# EasyEDA Pro project DCDC.eprj, board FSBB_自举驱动
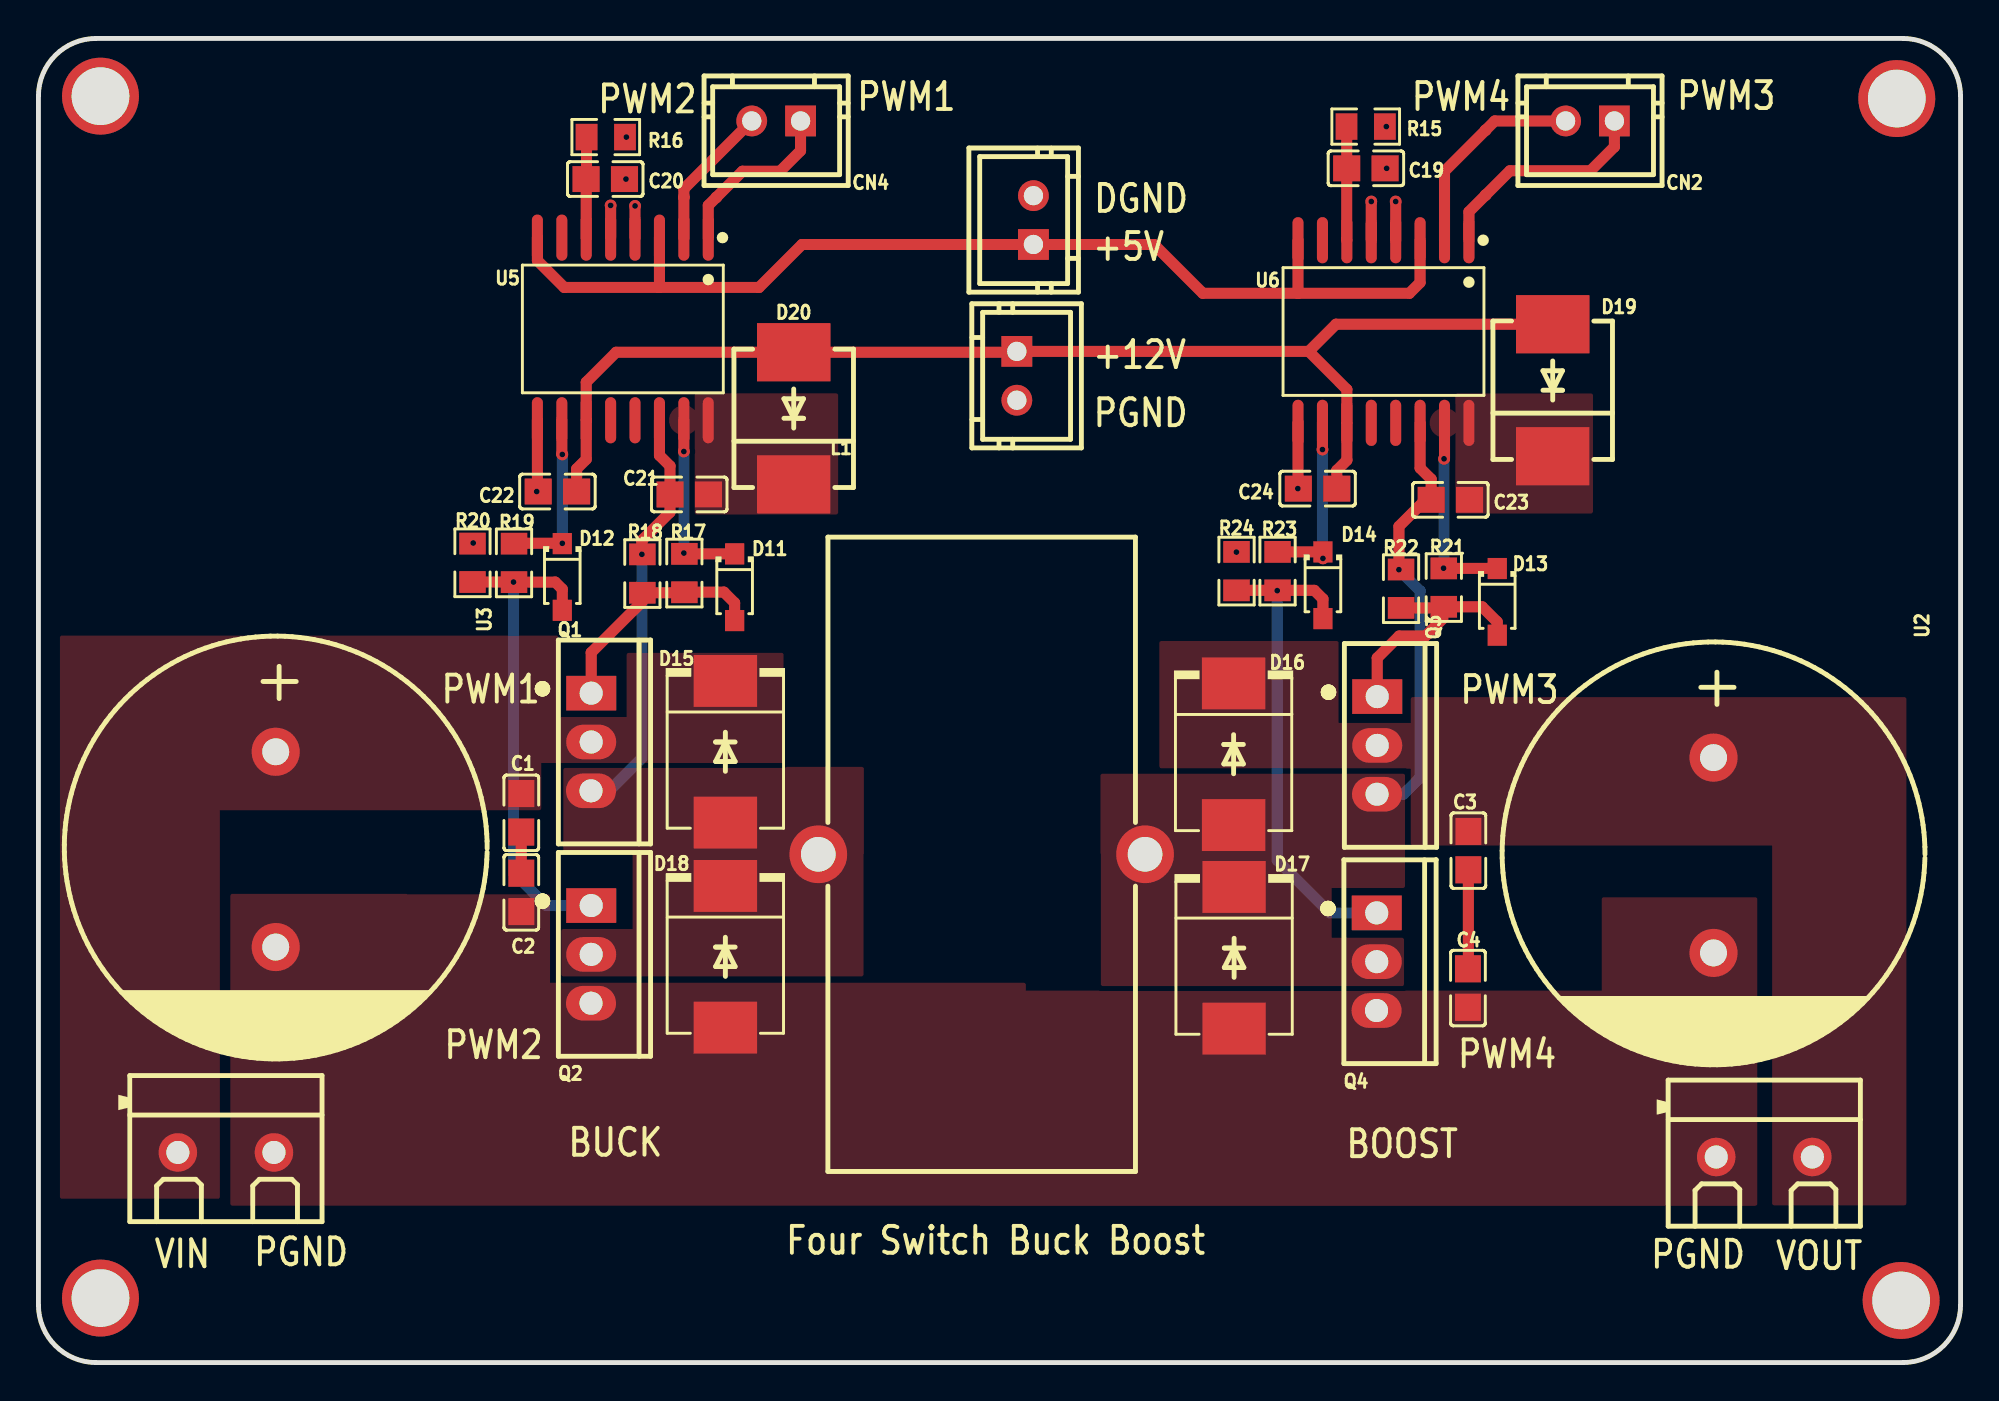
[diagram p6: board, top side]
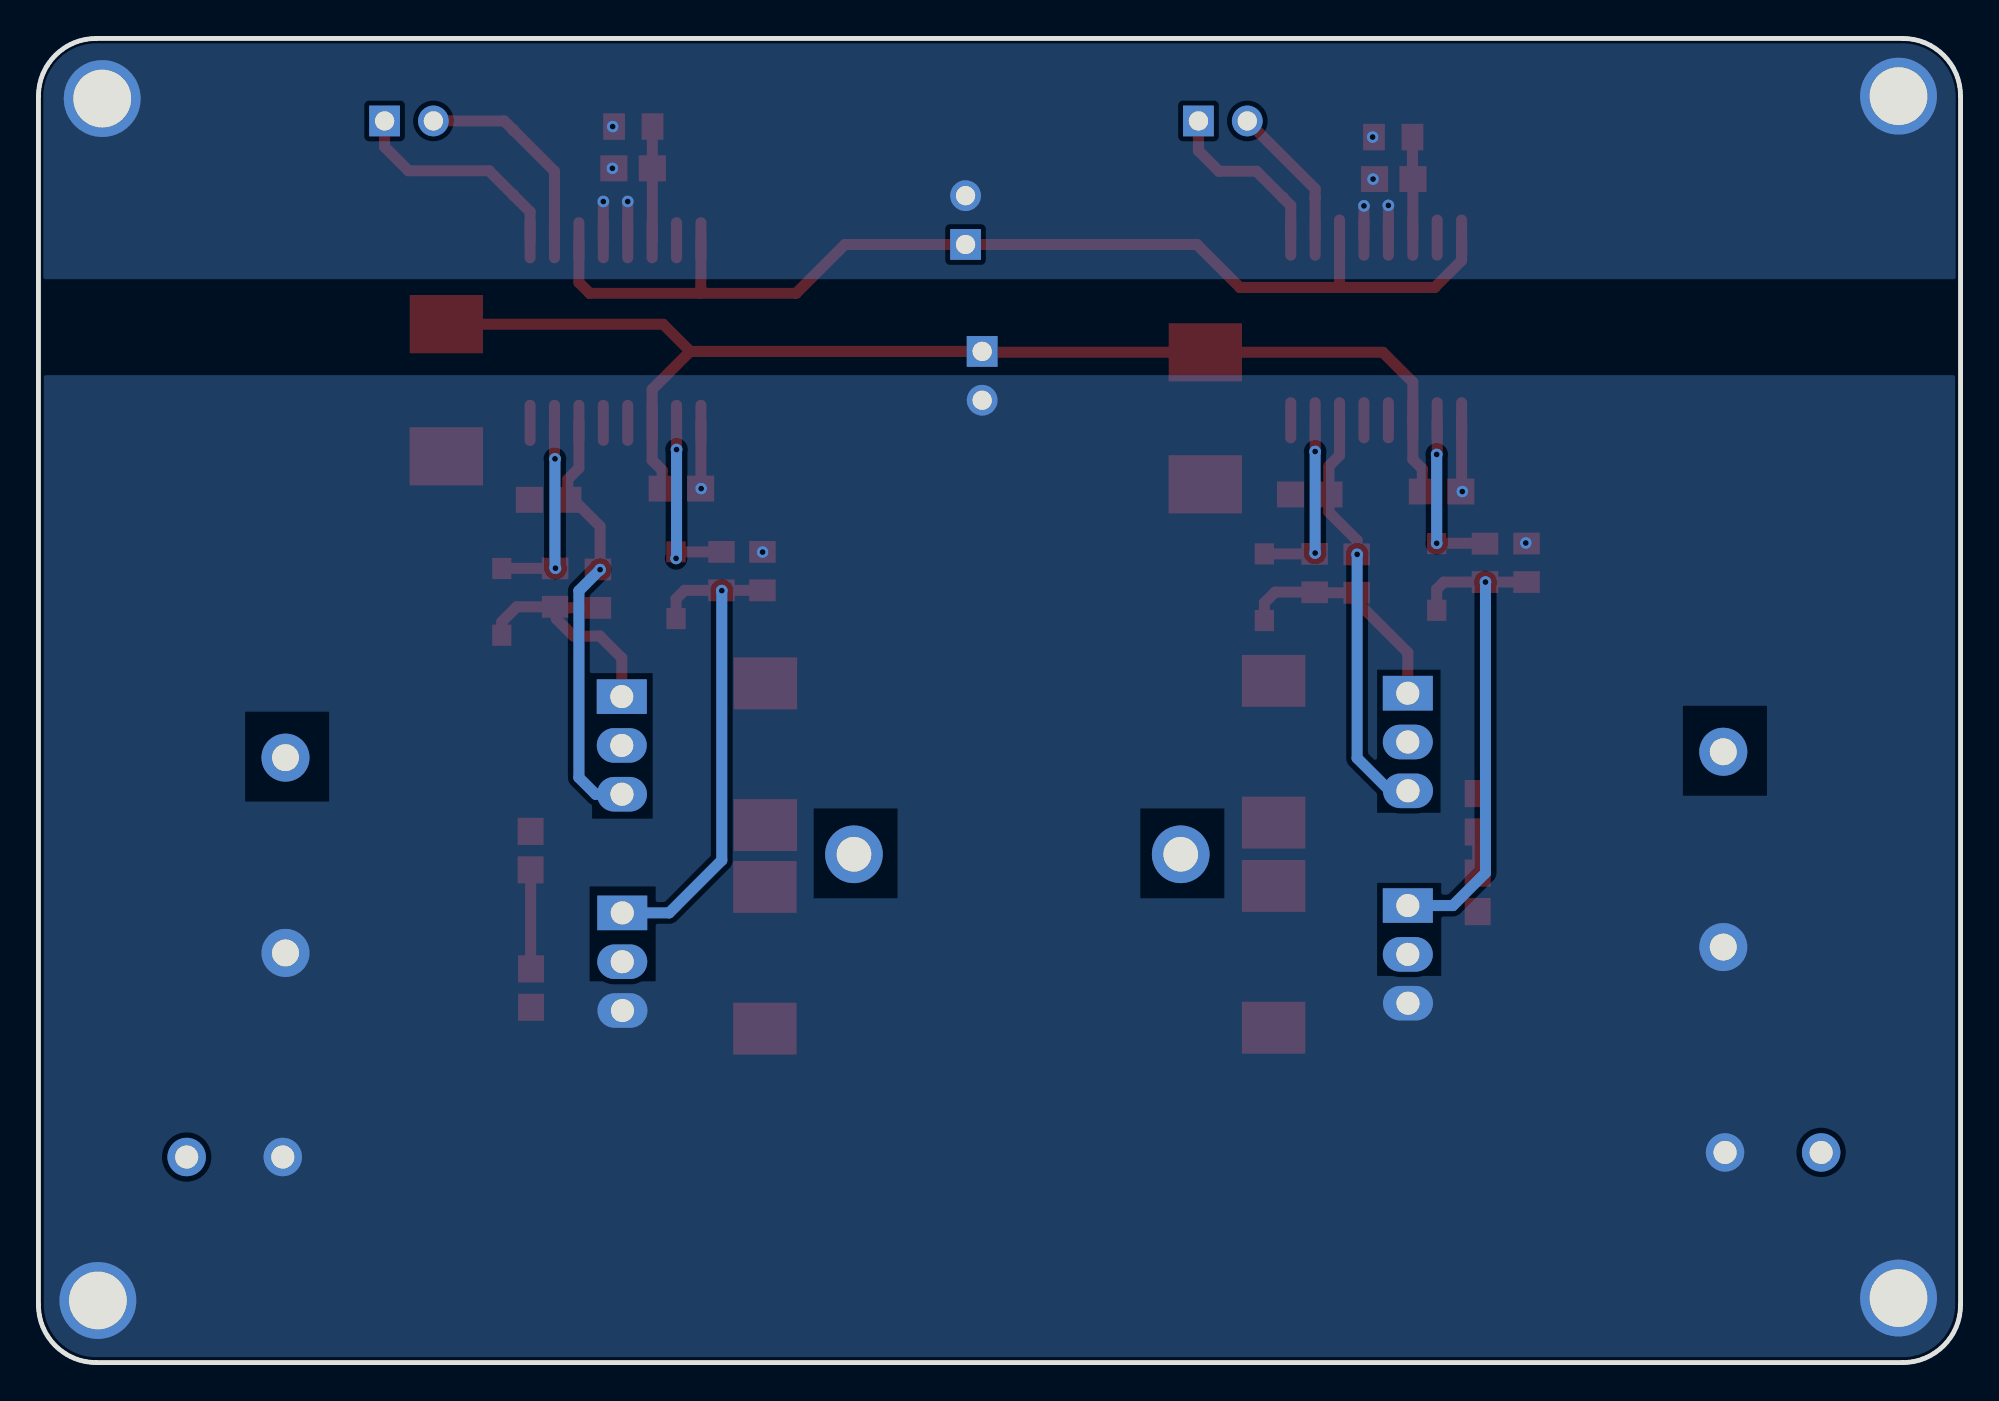
[diagram p7: board, bottom side, seen from below]

Outline 100 x 68.88 mm; copper layers: Top Layer, Bottom Layer. Coordinates in mm from the lower left corner of the outline.
Outline path: 0,65.88 0,3 arc(0.88,0.88) 3,0 97,0 arc(99.12,0.88) 100,3 100,65.88 arc(99.12,68.01) 97,68.88 3,68.88 arc(0.88,68.01) 0,65.88
Stack: Top Layer 0.035mm / Dielectric1 1.51mm FR4 er 4.5 / Bottom Layer 0.035mm

## Design rules (mm)
template: 自定义配置
spacing copperThickness1oz (default): track to track 0.102, other pairs 0.152 to 0.3
spacing copperThickness2oz: track to track 0.203, other pairs 0.152 to 0.3
track width copperThickness1oz (default): min 0.127, default 0.254, max 2.54
track width copperThickness2oz: min 0.203, default 0.254, max 2.54
differential pair differentialPair (default): width min 0.127, default 0.254, max 2.54; gap min 0.152, default 0.152
via viaSize (default): diameter min 0.5, default 0.61, max 10; hole min 0.3, default 0.305, max 6.3

## Placement (name value [footprint] x y rotation side)
C1  100nF  [C0805]  25.12 28.6 90 top
C2  100nF  [C0805]  25.12 24.46 90 top
C3  100nF  [C0805]  74.39 26.63 90 top
C4  100nF  [C0805]  74.37 19.48 90 top
C19  100nF  [C0805]  69.06 62.13 180 top
C20  100nF  [C0805]  29.49 61.57 180 top
C21  100nF  [C0805]  33.86 45.16 0 top
C22  100nF  [C0805]  27 45.31 0 top
C23  100nF  [C0805]  73.46 44.88 0 top
C24  100nF  [C0805]  66.55 45.47 0 top
CN1  CON2-2.54*2P  [CONN-TH_2P-P2.54-V]  51.77 59.44 90 top
CN2  CON2-2.54*2P  [CONN-TH_2P-P2.54-V]  80.72 64.59 180 top
CN3  CON2-2.54*2P  [CONN-TH_2P-P2.54-V]  50.9 51.33 270 top
CN4  CON2-2.54*2P  [CONN-TH_2P-P2.54-V]  38.38 64.59 180 top
D11  1N4148W  [SOD-123F_L2.7-W1.6-LS3.8-RD]  36.22 40.34 270 top
D12  1N4148W  [SOD-123F_L2.7-W1.6-LS3.8-RD]  27.25 40.87 270 top
D13  1N4148W  [SOD-123F_L2.7-W1.6-LS3.8-RD]  75.9 39.57 270 top
D14  1N4148W  [SOD-123F_L2.7-W1.6-LS3.8-RD]  66.83 40.44 270 top
D15  SK106  [SMC_L6.9-W5.9-LS7.9-RD]  35.74 31.78 270 top
D16  SK106  [SMC_L6.9-W5.9-LS7.9-RD]  62.18 31.65 270 top
D17  SK106  [SMC_L6.9-W5.9-LS7.9-RD]  62.2 21.06 270 top
D18  SK106  [SMC_L6.9-W5.9-LS7.9-RD]  35.74 21.11 270 top
D19  RS3MC  [SMC_L7.1-W6.2-LS8.1-R-RD]  78.78 50.58 90 top
D20  RS3MC  [SMC_L7.1-W6.2-LS8.1-R-RD]  39.29 49.12 90 top
L1  47uH  [IND-TH_L33.0-W16.0-P17.00-D1.5]  49.07 26.44 0 top
NOREF  -  [Pad_e730]  35.26 60.61 0 top
NOREF#2  -  [Pad_e697]  96.68 65.76 0 top
NOREF#3  -  [Pad_e742]  75.29 64.12 0 top
NOREF#4  -  [Pad_e695]  3.23 65.88 0 top
NOREF#5  -  [Pad_e698]  96.91 3.23 0 top
NOREF#6  -  [Pad_e736]  75.29 60.74 0 top
NOREF#7  -  [Pad_e724]  33.58 60.62 0 top
NOREF#8  -  [Pad_e699]  3.23 3.35 0 top
P1  KF301-2P接线端子  [CONN-TH_XY301V-A-5.0-2P]  9.75 10.93 180 top
P2  KF301-2P接线端子  [CONN-TH_XY301V-A-5.0-2P]  89.79 10.69 180 top
Q1  CSD19536KCS  [TO-220-3_L10.0-W4.5-P2.54-L]  28.75 32.28 270 top
Q2  CSD19536KCS  [TO-220-3_L10.0-W4.5-P2.54-L]  28.75 21.23 270 top
Q3  CSD19536KCS  [TO-220-3_L10.0-W4.5-P2.54-L]  69.65 32.11 270 top
Q4  CSD19536KCS  [TO-220-3_L10.0-W4.5-P2.54-L]  69.62 20.85 270 top
R15  10K  [R0805]  69.05 64.3 180 top
R16  10K  [R0805]  29.52 63.75 180 top
R17  2  [R0805]  33.6 41.07 270 top
R18  10K  [R0805]  31.42 41.05 270 top
R19  2  [R0805]  24.74 41.6 270 top
R20  10K  [R0805]  22.58 41.61 270 top
R21  2  [R0805]  73.12 40.32 270 top
R22  10K  [R0805]  70.89 40.26 270 top
R23  2  [R0805]  64.47 41.17 270 top
R24  10K  [R0805]  62.33 41.17 270 top
U2  220uF  [CAP-TH_BD22.0-P10.00-D1.4-FD]  87.15 26.39 270 top
U3  220uF  [CAP-TH_BD22.0-P10.00-D1.4-FD]  12.34 26.7 270 top
U5  UCC21520DW  [SOIC-16_L10.3-W7.5-P1.27-LS10.3-BL]  30.4 53.77 180 top
U6  UCC21520DW  [SOIC-16_L10.3-W7.5-P1.27-LS10.3-BL]  69.98 53.64 180 top

## Footprints (pads in the part's own frame, mm; a bottom-side part is the same pattern mirrored in y, then rotated)
C0805
  rect 1.41x1.35 smd: 1(-1,0) 2(1,0)
CAP-TH_BD22.0-P10.00-D1.4-FD
  round 2.5 hole 1.4: 1(-5.08,0) 2(5.08,0)
CONN-TH_2P-P2.54-V
  rect 1.6x1.6 hole 1: 1(-1.27,0)
  round 1.6 hole 1: 2(1.27,0)
CONN-TH_XY301V-A-5.0-2P
  round 2 hole 1.2: 1(-2.5,0) 2(2.5,0)
IND-TH_L33.0-W16.0-P17.00-D1.5
  round 3 hole 1.8: 1(-8.5,0) 2(8.5,0)
Pad_e695
  round 4 hole 3: 1(0,0)
Pad_e697
  round 4 hole 3: 1(0,0)
Pad_e698
  round 4 hole 3: 1(0,0)
Pad_e699
  round 4 hole 3: 1(0,0)
Pad_e724
  round 0.61 smd: TP1(0,0)
Pad_e730
  round 0.61 smd: TP2(0,0)
Pad_e736
  round 0.61 smd: TP3(0,0)
Pad_e742
  round 0.61 smd: TP4(0,0)
R0805
  rect 1.133x1.377 smd: 1(-1,0) 2(1,0)
SMC_L6.9-W5.9-LS7.9-RD
  rect 2.7x3.3 smd: 1(-3.687,0) 2(3.687,0)
SMC_L7.1-W6.2-LS8.1-R-RD
  rect 3.03x3.82 smd: 1(3.435,0) 2(-3.435,0)
SOD-123F_L2.7-W1.6-LS3.8-RD
  rect 1.1x1 smd: 1(-1.735,0) 2(1.735,0)
SOIC-16_L10.3-W7.5-P1.27-LS10.3-BL
  oval 0.574x2.401 smd: 1(-4.445,-4.75) 2(-3.175,-4.75) 3(-1.905,-4.75) 4(-0.635,-4.75) 5(0.635,-4.75) 6(1.905,-4.75) 7(3.175,-4.75) 8(4.445,-4.75) 9(4.445,4.75) 10(3.175,4.75) 11(1.905,4.75) 12(0.635,4.75) 13(-0.635,4.75) 14(-1.905,4.75) 15(-3.175,4.75) 16(-4.445,4.75)
TO-220-3_L10.0-W4.5-P2.54-L
  rect 1.8x2.6 hole 1.2: 1(-2.54,0.005)
  oval 1.8x2.6 hole 1.2: 2(0,0.005) 3(2.54,-0.005)

## Nets
+5V: CN1.1 U5.3 U5.8 U6.3 U6.8
+12V: C22.2 C24.2 CN3.1 D19.1 D20.1 U5.11 U6.11
GND: C19.1 C20.1 CN1.2 NOREF#2.1 NOREF#4.1 R15.1 R16.1 U5.4 U5.5 U6.4 U6.5
PGND: C2.1 C4.1 C22.1 C24.1 CN3.2 D17.2 D18.2 NOREF#5.1 NOREF#8.1 P1.1 P2.2 Q2.3 Q4.3 R20.1 R24.1 U2.2 U3.2 U5.9 U6.9
G1: D11.2 Q1.1 R17.2 R18.2
G2: D12.2 Q2.1 R19.2 R20.2
G3: D13.2 Q3.1 R21.2 R22.2
G4: D14.2 Q4.1 R23.2 R24.2
PWM1: CN4.1 NOREF.TP2 U5.1
PWM2: CN4.2 NOREF#7.TP1 U5.2
PWM3: CN2.1 NOREF#6.TP3 U6.1
PWM4: CN2.2 NOREF#3.TP4 U6.2
S1: D11.1 R17.1 U5.15
S2: D12.1 R19.1 U5.10
S3: D13.1 R21.1 U6.15
S4: D14.1 R23.1 U6.10
VDC: C1.2 D15.1 P1.2 Q1.2 U3.1
VOUT: C3.2 D16.1 P2.1 Q3.2 U2.1
VS1: C21.1 D15.2 D18.1 L1.1 Q1.3 Q2.2 R18.1 U5.14
VS2: C23.1 D16.2 D17.1 L1.2 Q3.3 Q4.2 R22.1 U6.14
$1N2741: C1.1 C2.2
$1N2744: C3.1 C4.2
$1N2771: C23.2 D19.2 U6.16
$1N2772: C20.2 R16.2 U5.6
$1N2774: C19.2 R15.2 U6.6
$1N7060: C21.2 D20.2 U5.16

Pads without a net: U5 7 12 13; U6 7 12 13

## Via types
v1: diameter 0.61, hole 0.305, Top Layer to Bottom Layer, 24 vias

## Routing (per net, layer and track width the routed paths; a pad name or vN(x,y) marks a point on that pad's centre or on a via; arc(x,y) is an arc through that point)
+5V: length 57.5
  Top Layer w0.574: 32.31,55.93 27.36,55.93 25.96,57.33 U5.8 ; 32.31,55.93 37.49,55.93 39.73,58.17 CN1.1 58.04,58.17 60.58,55.63 65.55,55.63 ; 32.31,55.93 U5.3 ; 65.55,55.63 65.53,55.64 U6.8 ; 65.55,55.63 71.32,55.63 71.88,56.18 U6.3
+12V: length 65.6
  Top Layer w0.574: C24.2 67.55,46.42 68.07,46.94 U6.11 68.07,50.62 66.09,52.6 ; D19.1 67.51,54.02 66.09,52.6 ; 66.09,52.6 CN3.1 50.86,52.56 D20.1 30.05,52.56 28.5,51 U5.11 28.5,46.99 28,46.49 C22.2
GND: length 7.4
  Top Layer w0.574: U5.5 v1(29.77,60.2) ; U5.4 v1(31.04,60.17) ; U6.5 v1(69.34,60.4) ; U6.4 v1(70.61,60.4)
  vias: v1(30.57,61.57) v1(30.59,63.75) v1(70.13,64.3) v1(70.14,62.13)
PGND: length 7.2
  Top Layer w0.574: U5.9 25.96,45.35 C22.1 ; U6.9 65.53,45.48 C24.1
  vias: v1(22.62,42.64) v1(25.92,45.31) v1(62.33,42.16) v1(65.52,45.47)
G1: length 12.3
  Top Layer w0.574: Q1.1 28.76,36.94 31.42,39.6 R18.2 33.58,40.05 R17.2 33.61,40.08 35.66,40.08 36.22,39.52 D11.2
G2: length 25.8
  Top Layer w0.574: R20.2 v1(24.72,40.61) 24.74,40.6 R19.2 26.89,40.6 27.25,40.23 D12.2
  Bottom Layer w0.574: Q2.1 26.42,23.77 24.72,25.47 v1(24.72,40.6)
G3: length 12.9
  Top Layer w0.574: 73.06,39.26 73.06,38.69 72.16,37.8 70.79,37.8 69.65,36.66 Q3.1 ; 73.06,39.26 R22.2 ; 73.06,39.26 R21.2 75.11,39.32 75.9,38.53 D13.2
G4: length 26.1
  Top Layer w0.574: 64.46,40.17 v1(64.45,40.16) 64.43,40.17 R24.2 ; R23.2 66.38,40.17 66.83,39.73 D14.2
  Bottom Layer w0.574: v1(64.45,40.16) 64.45,26.13 67.18,23.39 Q4.1
PWM1: length 9.2
  Top Layer w0.574: CN4.1 39.65,63.04 38.58,61.98 36.63,61.98 NOREF.TP2 34.85,60.2 U5.1
PWM2: length 7.5
  Top Layer w0.574: 33.58,58.52 NOREF#7.TP1 33.58,61.06 CN4.2
PWM3: length 11.8
  Top Layer w0.574: CN2.1 81.99,63.25 80.75,62 76.56,62 NOREF#6.TP3 74.42,59.87 U6.1
PWM4: length 11
  Top Layer w0.574: CN2.2 75.77,64.59 NOREF#3.TP4 73.15,61.98 U6.2
S1: length 9.6
  Top Layer w0.574: 33.58,49.02 v1(33.58,47.4) ; D11.1 33.62,42.07 v1(33.58,42.11)
  Bottom Layer w0.574: v1(33.58,47.4) v1(33.58,42.11)
S2: length 8.9
  Top Layer w0.574: R19.1 24.76,42.62 v1(27.25,42.62) ; v1(27.25,47.24) 27.23,47.27 27.23,49.02
  Bottom Layer w0.574: v1(27.25,47.24) v1(27.25,42.62)
S3: length 10.4
  Top Layer w0.574: R21.1 75.89,41.32 75.9,41.31 ; U6.15 73.15,47.04 v1(73.13,47.02)
  Bottom Layer w0.574: v1(73.13,47.02) 73.13,41.35 v1(73.1,41.33)
S4: length 9.9
  Top Layer w0.574: R23.1 66.49,42.17 v1(66.83,41.83) D14.1 ; U6.10 v1(66.8,47.5)
  Bottom Layer w0.574: v1(66.83,41.83) 66.8,41.86 v1(66.8,47.5)
VS1: length 21.8
  Top Layer w0.574: v1(31.39,42.05) 31.39,42.77 32.86,44.24 C21.1 32.86,46.64 32.31,47.19 U5.14
  Bottom Layer w0.574: Q1.3 29.69,29.74 31.39,31.45 v1(31.39,42.05)
VS2: length 22.6
  Top Layer w0.574: U6.14 71.88,46.53 72.46,45.96 C23.1 72.16,44.88 70.78,43.5 v1(70.78,41.25)
  Bottom Layer w0.574: Q3.3 71.01,29.57 71.88,30.43 71.88,40.15 v1(70.78,41.25)
$1N2741: length 2.1
  Top Layer w0.574: C1.1 C2.2
$1N2744: length 5.2
  Top Layer w0.574: C3.1 74.39,20.5 C4.2
$1N2772: length 5.2
  Top Layer w0.574: R16.2 28.52,61.59 C20.2 28.5,61.56 U5.6
$1N2774: length 5.9
  Top Layer w0.574: R15.2 68.06,64.29 C19.2 68.06,58.4 U6.6

## Copper pours and planes (outline as drawn; the poured copper is in the pictures)
GND on Bottom Layer: -0.58,69.29 100.66,69.29 100.66,56.36 -0.58,56.36
PGND on Top Layer: 48.97,8.15 48.97,8.16 9.98,8.16 9.98,24.38 19.2,24.38 19.2,24.36 26.62,24.36 26.62,19.76 51.37,19.76 51.37,19.35 81.33,19.35 81.33,24.21 89.42,24.21 89.42,8.15
PGND on Bottom Layer: -0.58,51.39 100.48,51.39 100.48,-0.36 -0.58,-0.36
VDC on Top Layer: 26.16,31.19 26.16,28.74 9.44,28.74 9.44,8.52 1.12,8.52 1.12,37.82 27.05,37.82 27.05,33.58 30.6,33.58 30.6,36.92 38.76,36.92 38.76,31.19
VOUT on Top Layer: 71.37,30.87 58.29,30.87 58.29,37.57 67.67,37.57 67.67,33.3 71.37,33.3 71.37,34.65 97.21,34.65 97.21,8.15 90.17,8.15 90.17,26.87 71.37,26.87
VS1 on Top Layer: 42.94,26.44 42.93,26.44 42.93,20.09 27.2,20.09 27.2,22.56 30.91,22.56 30.91,26.44 27.31,26.44 27.31,30.99 42.94,30.99
VS2 on Top Layer: 55.25,26.44 55.27,26.44 55.27,19.58 71.04,19.58 71.04,22.1 67.29,22.1 67.29,24.69 71.1,24.69 71.1,30.63 55.25,30.63
$1N2771 on Top Layer: 73.69,50.44 80.9,50.44 80.9,44.15 73.69,44.15
$1N7060 on Top Layer: 34.12,50.45 41.63,50.45 41.63,44.09 34.12,44.09

## Text on the board
Top Silkscreen Layer: VIN | PGND | PWM1 | PWM2 | BUCK | Four Switch Buck Boost | +5V | +12V | DGND | BOOST | PWM4 | PWM3 | VOUT
